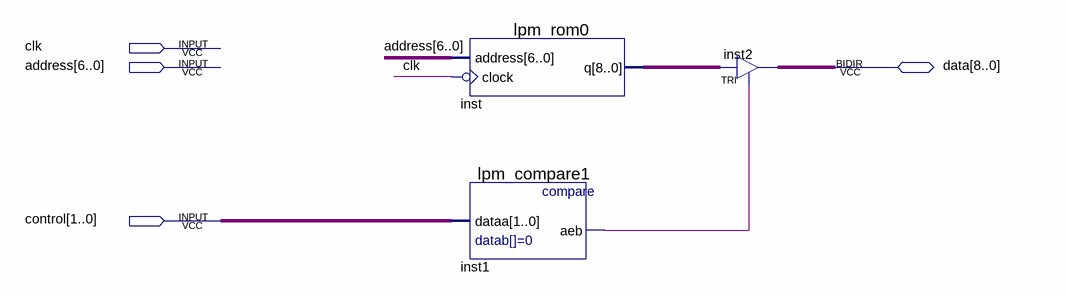
[diagram p0: schematic sheet]
// Quartus schematic ROM.bdf as structural Verilog: 3 symbols, 4 pins
module ROM (
  input  clk,
  input  [6:0] address,
  input  [1:0] control,
  inout  [8:0] data
);

  wire inst1_aeb;
  wire [8:0] inst_q;

  lpm_rom0 inst (.address(address), .clock(~clk), .q(inst_q));
  lpm_compare1 inst1 (.dataa(control), .aeb(inst1_aeb));
  TRI inst2[8:0] (.IN(inst_q), .OE(inst1_aeb), .OUT(data));
endmodule
